# Altium schematic sheet switch.SchDoc
size A4
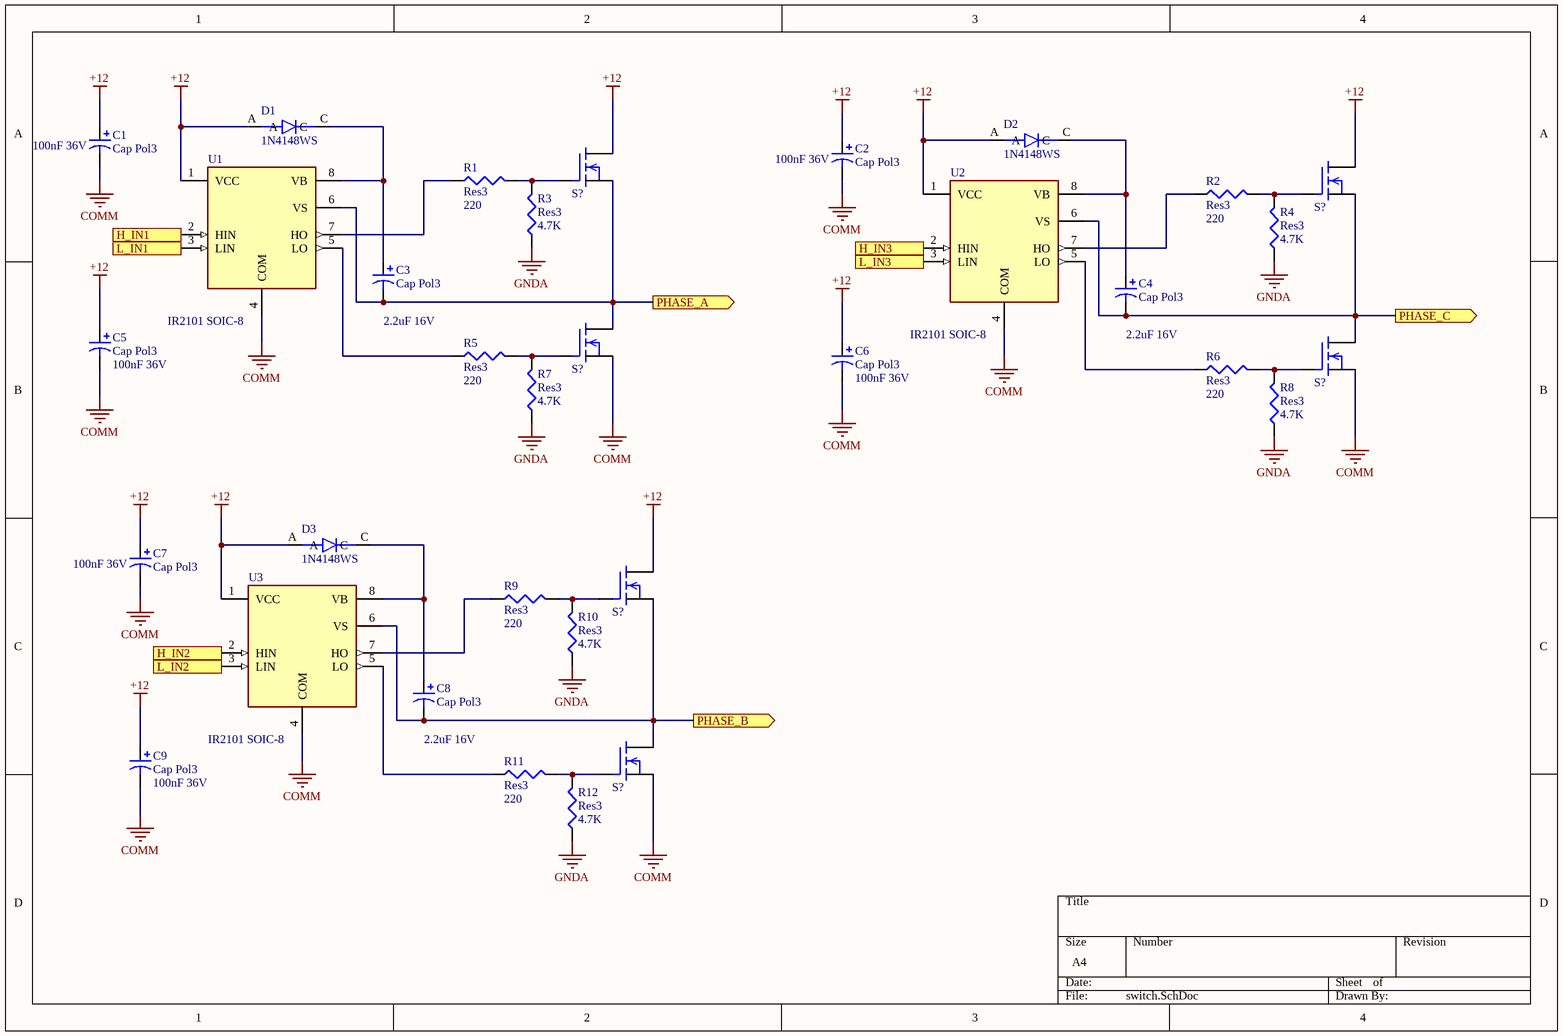
[diagram p0: switch.SchDoc]

## Parts
C1  Cap Pol3  value 100nF 36V  [C0805]
C2  Cap Pol3  value 100nF 36V  [C0805]
C3  Cap Pol3  value 2.2uF 16V  [C0805]
C4  Cap Pol3  value 2.2uF 16V  [C0805]
C5  Cap Pol3  value 100nF 36V  [C0805]
C6  Cap Pol3  value 100nF 36V  [C0805]
C7  Cap Pol3  value 100nF 36V  [C0805]
C8  Cap Pol3  value 2.2uF 16V  [C0805]
C9  Cap Pol3  value 100nF 36V  [C0805]
D1  1N4148WS  [1N4148WS]
D2  1N4148WS  [1N4148WS]
D3  1N4148WS  [1N4148WS]
NPN_1  S?  [UTM2054G - duplicate]
NPN_2  S?  [UTM2054G - duplicate]
NPN_3  S?  [UTM2054G - duplicate]
NPN_4  S?  [UTM2054G - duplicate]
NPN_5  S?  [UTM2054G - duplicate]
NPN_6  S?  [UTM2054G - duplicate]
R1  Res3  value 220  [J1-0603]
R2  Res3  value 220  [J1-0603]
R3  Res3  value 4.7K  [J1-0603]
R4  Res3  value 4.7K  [J1-0603]
R5  Res3  value 220  [J1-0603]
R6  Res3  value 220  [J1-0603]
R7  Res3  value 4.7K  [J1-0603]
R8  Res3  value 4.7K  [J1-0603]
R9  Res3  value 220  [J1-0603]
R10  Res3  value 4.7K  [J1-0603]
R11  Res3  value 220  [J1-0603]
R12  Res3  value 4.7K  [J1-0603]
U1  IR2101 SOIC-8  [IR2101]
U2  IR2101 SOIC-8  [IR2101]
U3  IR2101 SOIC-8  [IR2101]

## Ports
H_IN1 (in), H_IN2 (in), H_IN3 (in), L_IN1 (in), L_IN2 (in), L_IN3 (in), PHASE_A (out), PHASE_B (out), PHASE_C (out)

## Nets
+12: C1.1 C2.1 C5.1 C6.1 C7.1 C9.1 D1.A D2.A D3.A NPN_1.2(D) NPN_2.2(D) NPN_5.2(D) U1.1(VCC) U2.1(VCC) U3.1(VCC)
COMM: C1.2 C2.2 C5.2 C6.2 C7.2 C9.2 NPN_3.3(S) NPN_4.3(S) NPN_6.3(S) U1.4(COM) U2.4(COM) U3.4(COM)
GNDA: R3.1 R4.1 R7.1 R8.1 R10.1 R12.1
H_IN1: U1.2(HIN) ; port H_IN1
H_IN2: U3.2(HIN) ; port H_IN2
H_IN3: U2.2(HIN) ; port H_IN3
L_IN1: U1.3(LIN) ; port L_IN1
L_IN2: U3.3(LIN) ; port L_IN2
L_IN3: U2.3(LIN) ; port L_IN3
PHASE_A: C3.2 NPN_1.3(S) NPN_3.2(D) U1.6(VS) ; port PHASE_A
PHASE_B: C8.2 NPN_5.3(S) NPN_6.2(D) U3.6(VS) ; port PHASE_B
PHASE_C: C4.2 NPN_2.3(S) NPN_4.2(D) U2.6(VS) ; port PHASE_C
NetC3_1: C3.1 D1.C U1.8(VB)
NetC4_1: C4.1 D2.C U2.8(VB)
NetC8_1: C8.1 D3.C U3.8(VB)
NetNPN_1_1: NPN_1.1(G) R1.2 R3.2
NetNPN_2_1: NPN_2.1(G) R2.2 R4.2
NetNPN_3_1: NPN_3.1(G) R5.2 R7.2
NetNPN_4_1: NPN_4.1(G) R6.2 R8.2
NetNPN_5_1: NPN_5.1(G) R9.2 R10.2
NetNPN_6_1: NPN_6.1(G) R11.2 R12.2
NetR1_1: R1.1 U1.7(HO)
NetR2_1: R2.1 U2.7(HO)
NetR5_1: R5.1 U1.5(LO)
NetR6_1: R6.1 U2.5(LO)
NetR9_1: R9.1 U3.7(HO)
NetR11_1: R11.1 U3.5(LO)

## Library data of the parts
C1-C9 = Cap Pol3: Polarized Capacitor (Surface Mount); Published: 8-Jun-2000; LatestRevisionDate: 29-May-2009; LatestRevisionNote: IPC-7351 Footprint Added.; PackageReference: C0805; Publisher: Altium Limited; PackageDescription: Chip Capacitor
D1-D3 = 1N4148WS: Diode Standard 75V 150mA Surface Mount SOD-323F; MF: ON Semiconductor; Price: None; SnapEDA_Link: https://www.snapeda.com/parts/1N4148WS/ON%20Semiconductor/view-part/2747266/?ref=snap; Check_prices: https://www.snapeda.com/parts/1N4148WS/ON%20Semiconductor/view-part/2747266/?ref=eda; MP: 1N4148WS; Availability: Good; Value: *; Purchase-URL: https://pricing.snapeda.com/search/part/1N4148WS/?ref=eda; Package: SOD-323FL-2 ON Semiconductor
NPN_1-NPN_6 = UTM2054
R1-R12 = Res3: Resistor; Published: 8-Jun-2000; LatestRevisionDate: 29-May-2009; LatestRevisionNote: IPC-7351 Footprint Added.; PackageReference: J1-0603; Publisher: Altium Limited; PackageDescription: Chip Resistor
U1-U3 = IR2101 SOIC-8: Half-Bridge Gate Driver IC Non-Inverting 8-SOIC; MF: Infineon Technologies; Availability: Unavailable; Value: *; Package: SOIC-8 Infineon; Price: None; MP: IR2101S; SnapEDA_Link: https://www.snapeda.com/parts/IR2101S/Infineon%20Technologies/view-part/589975/?ref=snap; BuyPart: https://www.snapeda.com/parts/IR2101S/Infineon%20Technologies/view-part/589975/?ref=eda